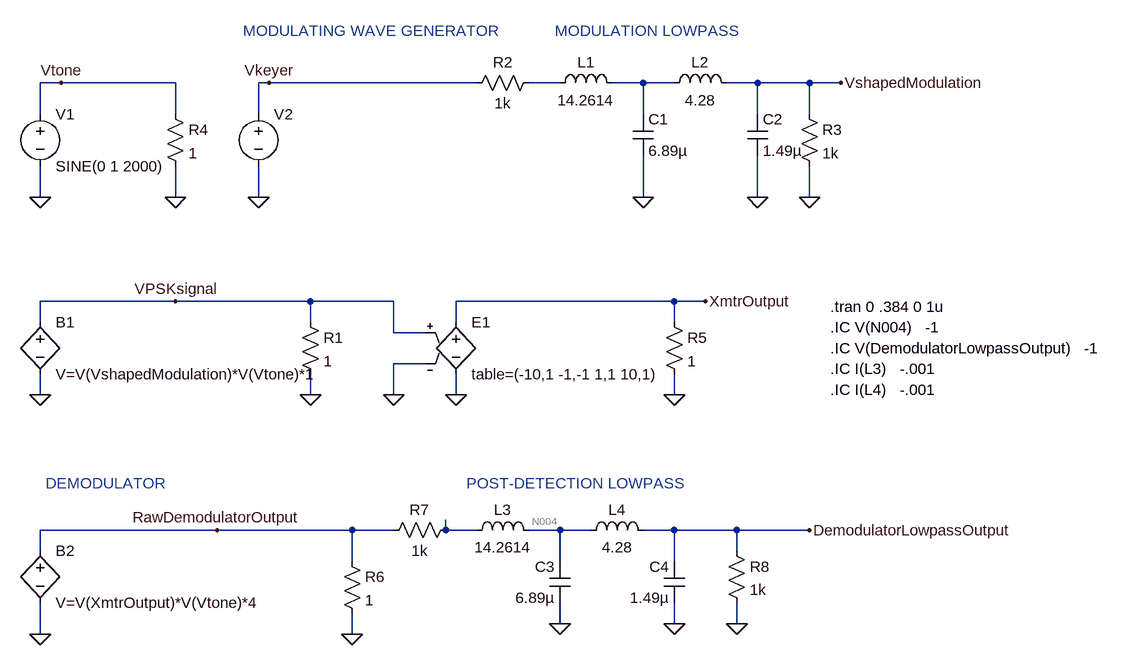
[diagram p0: schematic PSK31a.asc]
PSK31a.asc, the LTspice schematic file:
Version 4
SHEET 1 3336 1492
WIRE -672 -112 -704 -112
WIRE -496 -112 -672 -112
WIRE -352 -112 -368 -112
WIRE -32 -112 -352 -112
WIRE 96 -112 48 -112
WIRE 224 -112 176 -112
WIRE 272 -112 224 -112
WIRE 400 -112 352 -112
WIRE 480 -112 400 -112
WIRE 528 -112 480 -112
WIRE -704 -64 -704 -112
WIRE -496 -64 -496 -112
WIRE -368 -64 -368 -112
WIRE 224 -64 224 -112
WIRE 400 -64 400 -112
WIRE 480 -64 480 -112
WIRE -704 64 -704 16
WIRE -496 64 -496 16
WIRE -368 64 -368 16
WIRE 224 64 224 0
WIRE 400 64 400 0
WIRE 480 64 480 16
WIRE -496 224 -704 224
WIRE -288 224 -496 224
WIRE -160 224 -288 224
WIRE 272 224 -64 224
WIRE 320 224 272 224
WIRE -704 256 -704 224
WIRE -288 256 -288 224
WIRE -64 256 -64 224
WIRE 272 256 272 224
WIRE -160 272 -160 224
WIRE -112 272 -160 272
WIRE -112 320 -160 320
WIRE -704 368 -704 336
WIRE -288 368 -288 336
WIRE -160 368 -160 320
WIRE -64 368 -64 336
WIRE 272 368 272 336
WIRE -432 576 -704 576
WIRE -224 576 -432 576
WIRE -160 576 -224 576
WIRE -80 576 -80 560
WIRE -32 576 -80 576
WIRE 96 576 48 576
WIRE 144 576 96 576
WIRE 272 576 224 576
WIRE 368 576 272 576
WIRE 480 576 368 576
WIRE -704 608 -704 576
WIRE 368 608 368 576
WIRE -224 624 -224 576
WIRE 96 624 96 576
WIRE 272 624 272 576
WIRE 96 720 96 688
WIRE 272 720 272 688
WIRE 368 720 368 688
WIRE -704 736 -704 688
WIRE -224 736 -224 704
FLAG -704 368 0
FLAG -704 64 0
FLAG -368 64 0
FLAG -672 -112 Vtone
FLAG -352 -112 Vkeyer
FLAG -288 368 0
FLAG 224 64 0
FLAG 400 64 0
FLAG 480 64 0
FLAG 528 -112 VshapedModulation
FLAG -496 64 0
FLAG -496 224 VPSKsignal
FLAG -64 368 0
FLAG -160 368 0
FLAG 272 368 0
FLAG 320 224 XmtrOutput
FLAG -704 736 0
FLAG -224 736 0
FLAG 96 720 0
FLAG 272 720 0
FLAG 368 720 0
FLAG 480 576 DemodulatorLowpassOutput
FLAG -432 576 RawDemodulatorOutput
SYMBOL bv -704 240 R0
SYMATTR InstName B1
SYMATTR Value V=V(VshapedModulation)*V(Vtone)*1
SYMBOL voltage -704 -80 R0
WINDOW 123 0 0 Left 0
WINDOW 39 0 0 Left 0
SYMATTR InstName V1
SYMATTR Value SINE(0 1 2000)
SYMBOL voltage -368 -80 R0
WINDOW 123 0 0 Left 0
WINDOW 39 0 0 Left 0
WINDOW 3 24 104 Invisible 0
SYMATTR Value PWL(0 -2 .001 2 .032 2 .033 -2 .064 -2 .065 2 .128 2 .129 -2 .192 -2 .193 2 .224 2 .225 -2 .256 -2 .257 2 .320 2 .321 -2 .384 -2)
SYMATTR InstName V2
SYMBOL res -304 240 R0
SYMATTR InstName R1
SYMATTR Value 1
SYMBOL res -48 -96 R270
WINDOW 0 32 56 VTop 0
WINDOW 3 0 56 VBottom 0
SYMATTR InstName R2
SYMATTR Value 1k
SYMBOL ind 80 -96 R270
WINDOW 0 32 56 VTop 0
WINDOW 3 5 56 VBottom 0
SYMATTR InstName L1
SYMATTR Value 14.2614
SYMBOL ind 256 -96 R270
WINDOW 0 32 56 VTop 0
WINDOW 3 5 56 VBottom 0
SYMATTR InstName L2
SYMATTR Value 4.28
SYMBOL cap 208 -64 R0
SYMATTR InstName C1
SYMATTR Value 6.89µ
SYMBOL cap 384 -64 R0
SYMATTR InstName C2
SYMATTR Value 1.49µ
SYMBOL res 464 -80 R0
SYMATTR InstName R3
SYMATTR Value 1k
SYMBOL res -512 -80 R0
SYMATTR InstName R4
SYMATTR Value 1
SYMBOL e -64 240 R0
SYMATTR InstName E1
SYMATTR Value table=(-10,1 -1,-1 1,1 10,1)
SYMBOL res 256 240 R0
SYMATTR InstName R5
SYMATTR Value 1
SYMBOL bv -704 592 R0
SYMATTR InstName B2
SYMATTR Value V=V(XmtrOutput)*V(Vtone)*4
SYMBOL res -240 608 R0
SYMATTR InstName R6
SYMATTR Value 1
SYMBOL res -64 560 R90
WINDOW 0 0 56 VBottom 0
WINDOW 3 32 56 VTop 0
SYMATTR InstName R7
SYMATTR Value 1k
SYMBOL ind -48 592 R270
WINDOW 0 32 56 VTop 0
WINDOW 3 5 56 VBottom 0
SYMATTR InstName L3
SYMATTR Value 14.2614
SYMBOL ind 128 592 R270
WINDOW 0 32 56 VTop 0
WINDOW 3 5 56 VBottom 0
SYMATTR InstName L4
SYMATTR Value 4.28
SYMBOL cap 112 624 M0
SYMATTR InstName C3
SYMATTR Value 6.89µ
SYMBOL cap 288 624 M0
SYMATTR InstName C4
SYMATTR Value 1.49µ
SYMBOL res 352 592 R0
SYMATTR InstName R8
SYMATTR Value 1k
TEXT 512 232 Left 0 !.tran 0 .384 0 1u
TEXT 512 264 Left 0 !.IC V(N004)   -1
TEXT 512 296 Left 0 !.IC V(DemodulatorLowpassOutput)   -1
TEXT 512 328 Left 0 !.IC I(L3)   -.001
TEXT 512 360 Left 0 !.IC I(L4)   -.001
TEXT -696 504 Left 0 ;DEMODULATOR
TEXT -48 504 Left 0 ;POST-DETECTION LOWPASS
TEXT -392 -192 Left 0 ;MODULATING WAVE GENERATOR
TEXT 88 -192 Left 0 ;MODULATION LOWPASS

The netlist it stands for:
* PSK31a.asc
B1 VPSKsignal 0 V=V(VshapedModulation)*V(Vtone)*1
V1 Vtone 0 SINE(0 1 2000)
V2 Vkeyer 0 PWL(0 -2 .001 2 .032 2 .033 -2 .064 -2 .065 2 .128 2 .129 -2 .192 -2 .193 2 .224 2 .225 -2 .256 -2 .257 2 .320 2 .321 -2 .384 -2)
R1 VPSKsignal 0 1
R2 Vkeyer N001 1k
L1 N001 N002 14.2614
L2 N002 VshapedModulation 4.28
C1 N002 0 6.89µ
C2 VshapedModulation 0 1.49µ
R3 VshapedModulation 0 1k
R4 Vtone 0 1
E1 XmtrOutput 0 VPSKsignal 0 table=(-10,1 -1,-1 1,1 10,1)
R5 XmtrOutput 0 1
B2 RawDemodulatorOutput 0 V=V(XmtrOutput)*V(Vtone)*4
R6 RawDemodulatorOutput 0 1
R7 N003 RawDemodulatorOutput 1k
L3 N003 N004 14.2614
L4 N004 DemodulatorLowpassOutput 4.28
C3 N004 0 6.89µ
C4 DemodulatorLowpassOutput 0 1.49µ
R8 DemodulatorLowpassOutput 0 1k
.tran 0 .384 0 1u
.IC V(N004)   -1
.IC V(DemodulatorLowpassOutput)   -1
.IC I(L3)   -.001
.IC I(L4)   -.001
* DEMODULATOR
* POST-DETECTION LOWPASS
* MODULATING WAVE GENERATOR
* MODULATION LOWPASS
.backanno
.end